# Altium schematic sheet Termistor.SchDoc
size A4
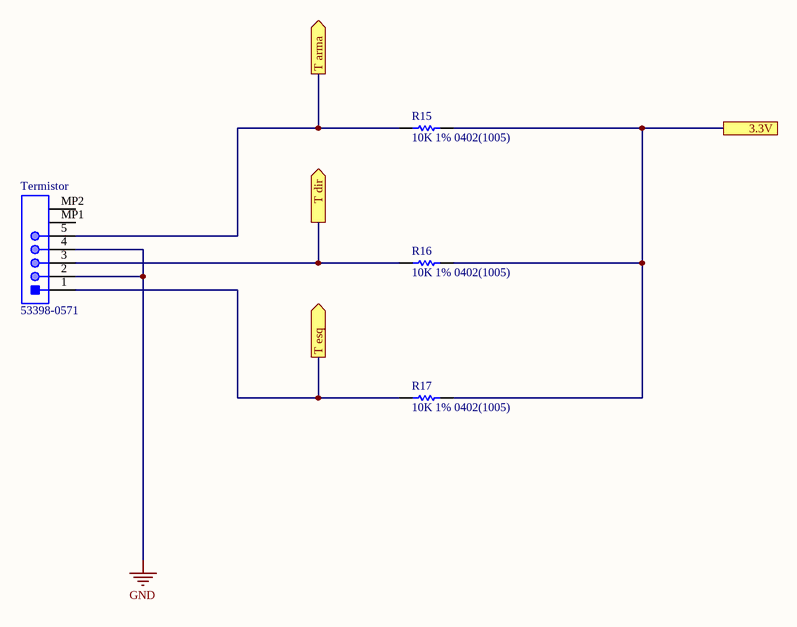
[diagram p0: Termistor.SchDoc]

## Parts
R15  10K 1% 0402(1005)  [RESC0402(1005)_L]
R16  10K 1% 0402(1005)  [RESC0402(1005)_L]
R17  10K 1% 0402(1005)  [RESC0402(1005)_L]
Termistor  53398-0571  [MOLX-53398-0571-5_V]

## Ports
3.3V, T arma (out), T dir (out), T esq (out)

## Nets
GND: Termistor.2 Termistor.4
3.3V: R15.2 R16.2 R17.2 ; port 3.3V
T arma: R15.1 Termistor.5 ; port T arma
T dir: R16.1 Termistor.3 ; port T dir
T esq: R17.1 Termistor.1 ; port T esq

Not connected (* = marked no-connect by the designer): Termistor MP1 MP2

## Library data of the parts
R15 = CMP-1011-00623-1: 10K 0.063W 1% 0402 (1005 Metric)  SMD                                    71-CRCW040210K0FKEDC; Case-Metric: 1005; Value: 10000.00 Ohm; Case-EIA: 0402; Tolerance: 1 %; Technology: SMT; Power: 0.063 W
R16 = CMP-1011-00623-1: 10K 0.063W 1% 0402 (1005 Metric)  SMD                                     71-CRCW040210K0FKEDC; Case-Metric: 1005; Value: 10000.00 Ohm; Case-EIA: 0402; Tolerance: 1 %; Technology: SMT; Power: 0.063 W
R17 = CMP-1011-00623-1: 10K 0.063W 1% 0402 (1005 Metric)  SMD                                        71-CRCW040210K0FKEDC; Case-Metric: 1005; Value: 10000.00 Ohm; Case-EIA: 0402; Tolerance: 1 %; Technology: SMT; Power: 0.063 W
Termistor = CMP-2000-05250-1: Male Header, Pitch 1.25 mm, 1 x 5 Postion, Height 4.7 mm, -40 to 85 degC, RoHS, Tape and Reel; Brand: Molex; Number of Positions: 5Position; Mounting Angle: Vertical; Current Rating: 1A; Pitch: 1.25mm; Voltage Rating: 125V; Type: Shrouded; Tradename: PicoBlade; Datasheet Version: Rev. E, 04/2006; Housing Material: Nylon; Datasheet URL: http://www.molex.com/pdm_docs/sd/533980571_sd.pdf; Termination Style: SMD; Contact Gender: Pin(Male); Factory Pack Quantity: 1000; Number of Rows: 1Row; Product: Headers; Package Reference: MOLX-53398-0571-5; Contact Material: PhosphorBronze; RoHS: Details; Manufacturer URL: http://www.molex.com/; Product Category: Headers&WireHousings; Contact Plating: Tin; Manufacturer: Molex; Series: 53398; Packaging: Reel; Mounting Style: SMD